# EAGLE schematic DCDC_combined (EAGLE 9.5.1)
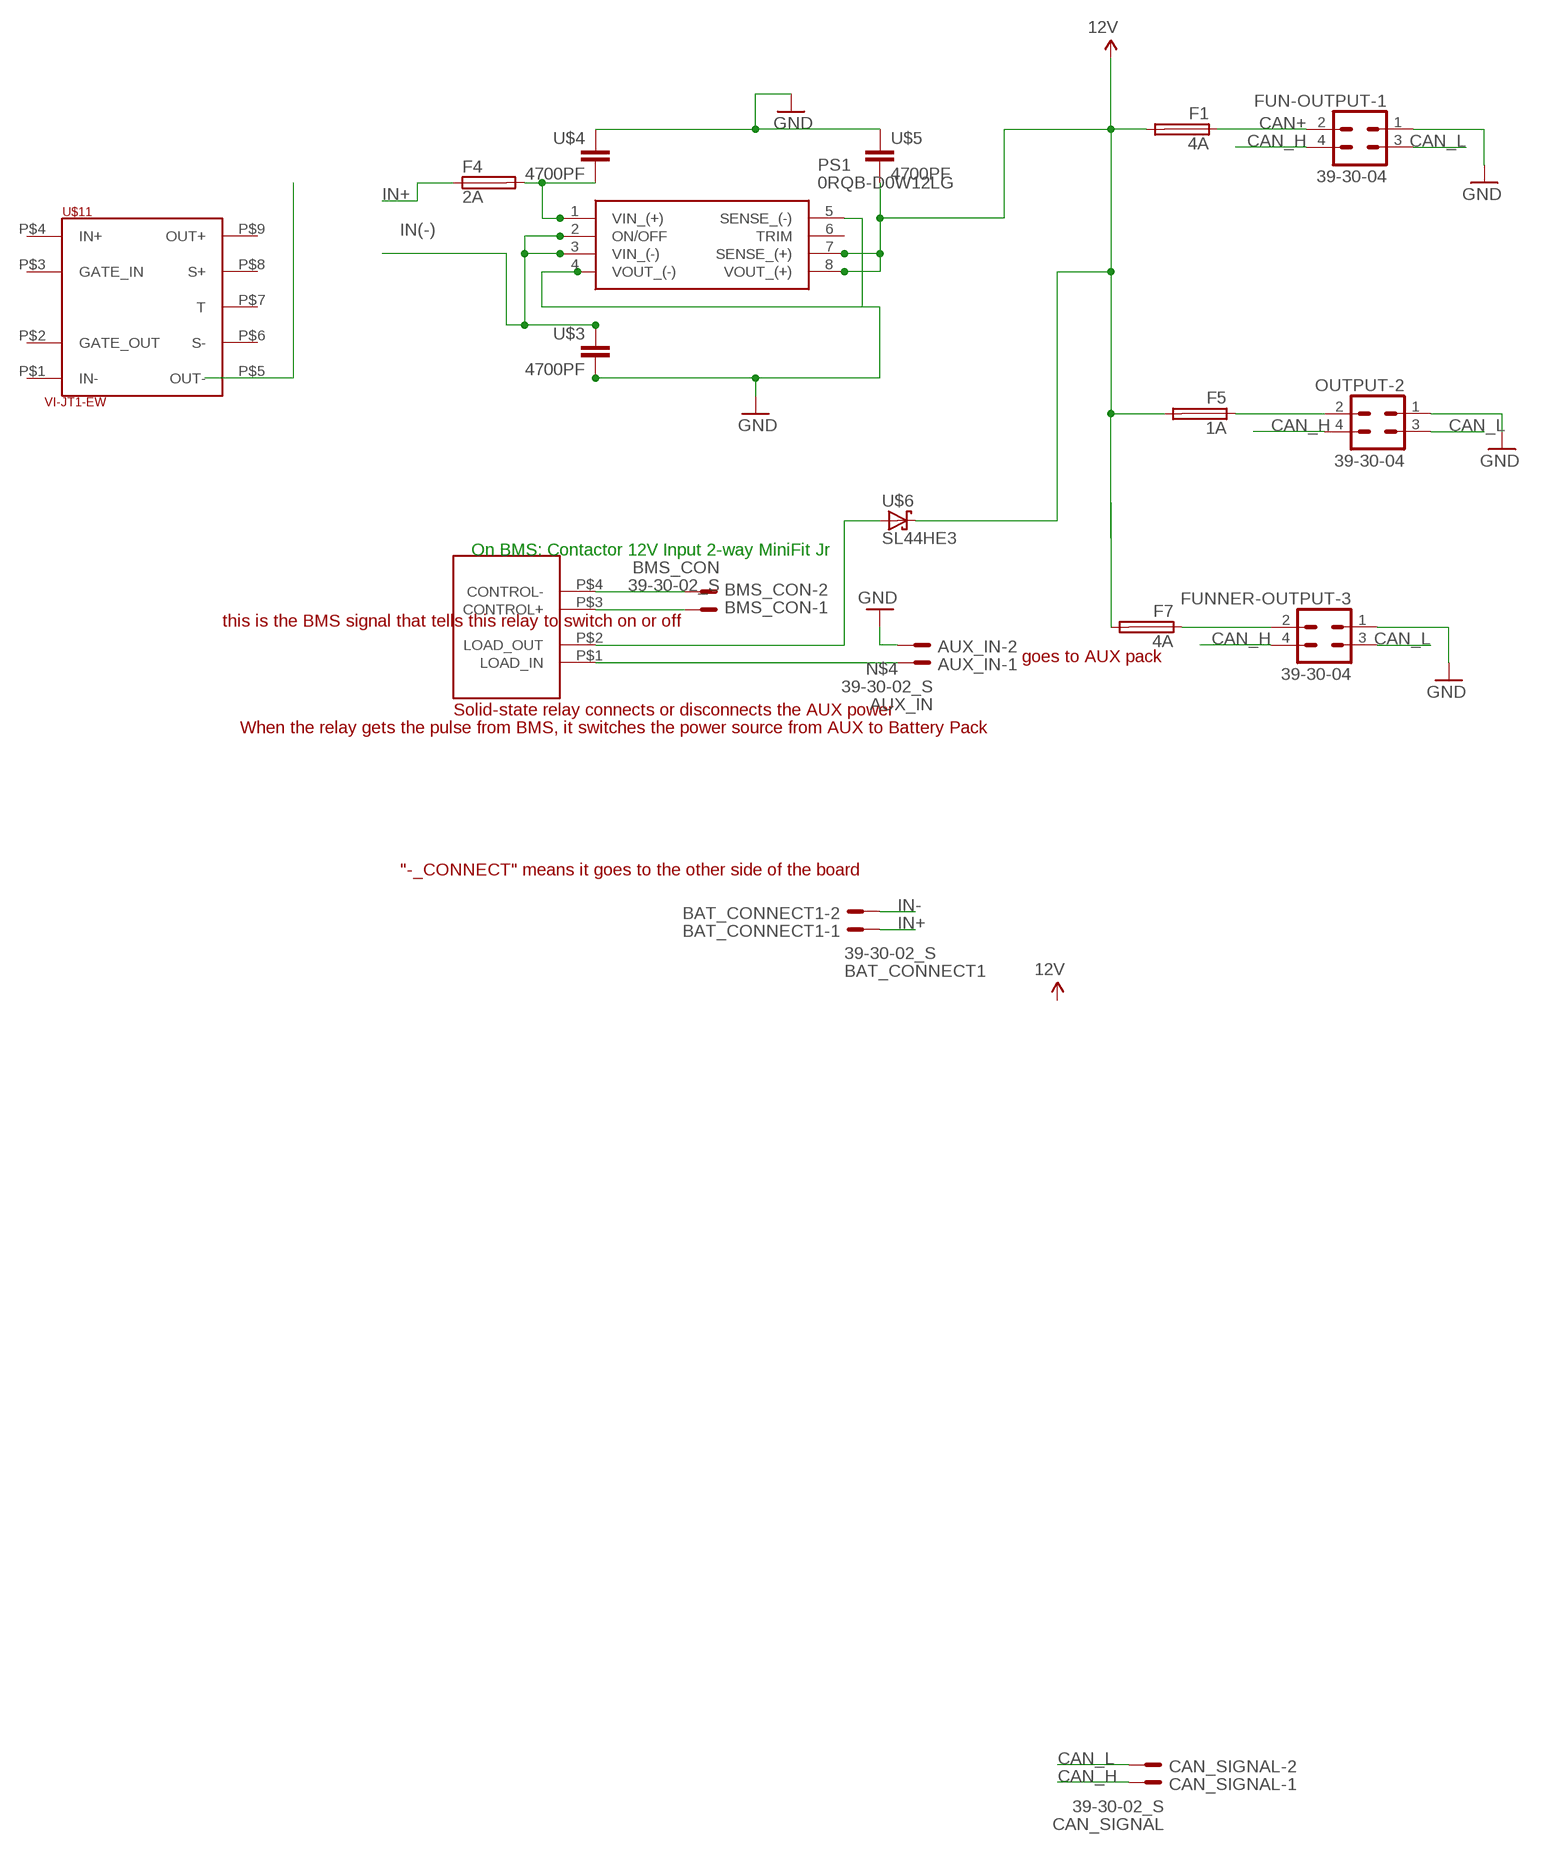
[diagram p0: schematic, sheet 1]

## Parts
AUX_IN  39-30-02_S  [39-30-?02?]
BAT_CONNECT1  39-30-02_S  [39-30-?02?]
BMS_CON  39-30-02_S  [39-30-?02?]
CAN_SIGNAL  39-30-02_S  [39-30-?02?]
F1  4A  SMD-MICRO-FUSE-BLOCK  [OMNIBLOK]
F4  2A  SMD-MICRO-FUSE-BLOCK  [OMNIBLOK]
F5  1A  SMD-MICRO-FUSE-BLOCK  [OMNIBLOK]
F7  4A  SMD-MICRO-FUSE-BLOCK  [OMNIBLOK]
FUN-OUTPUT-1  39-30-04  [39-30-?04?]
FUNNER-OUTPUT-3  39-30-04  [39-30-?04?]
OUTPUT-2  39-30-04  [39-30-?04?]
PS1  0RQB-D0W12LG  [0RQBD0W12LG]
U$2  MPDCD3B  [MPDCD3B]
U$3  4700PF  [Y2_CAP]
U$4  4700PF  [Y2_CAP]
U$5  4700PF  [Y2_CAP]
U$6  SL44HE3  [SMC]
U$11  VI-JT1-EW  [VI-J00]

## Nets
12V: F1.P$2 F5.P$2 PS1.7(SENSE_(+)) PS1.8(VOUT_(+)) U$5.P$2 U$6.C
CAN+: F1.P$1 FUN-OUTPUT-1.2
CAN_H: CAN_SIGNAL.1 FUN-OUTPUT-1.4 FUNNER-OUTPUT-3.4 OUTPUT-2.4
CAN_L: CAN_SIGNAL.2 FUN-OUTPUT-1.3 FUNNER-OUTPUT-3.3 OUTPUT-2.3
GND: AUX_IN.2 FUN-OUTPUT-1.1 FUNNER-OUTPUT-3.1 OUTPUT-2.1 PS1.4(VOUT_(-)) PS1.5(SENSE_(-)) U$3.P$2 U$4.P$1 U$5.P$1
IN(-): PS1.2(ON/OFF) PS1.3(VIN_(-)) U$3.P$1
IN+: BAT_CONNECT1.1 F4.P$1
IN-: BAT_CONNECT1.2
N$2: AUX_IN.1 U$2.P$1(LOAD_IN)
N$3: BMS_CON.1 U$2.P$3(CONTROL+)
N$4: BMS_CON.2 U$2.P$2(LOAD_OUT) U$2.P$4(CONTROL-) U$6.A
N$7: F5.P$1 OUTPUT-2.2
N$9: F4.P$2 PS1.1(VIN_(+)) U$4.P$2
N$10: F7.P$1 FUNNER-OUTPUT-3.2
N$13: F7.P$2
Unconnected: PS1.6(TRIM) U$11.P$1(IN-) U$11.P$2(GATE_OUT) U$11.P$3(GATE_IN) U$11.P$4(IN+) U$11.P$5(OUT-) U$11.P$6(S-) U$11.P$7(T) U$11.P$8(S+) U$11.P$9(OUT+)

## Notes on the sheet
- On BMS: Contactor 12V Input 2-way MiniFit Jr
- this is the BMS signal that tells this relay to switch on or off
- goes to AUX pack
- Solid-state relay connects or disconnects the AUX power
- When the relay gets the pulse from BMS, it switches the power source from AUX to Battery Pack
- "-_CONNECT" means it goes to the other side of the board

## Library data of the parts
AUX_IN BAT_CONNECT1 BMS_CON CAN_SIGNAL = con-molex-mini-fit:39-30-?02?_S: HEADER
F1 F4 F5 F7 = f-lf-omniblok-s:SMD-MICRO-FUSE
FUN-OUTPUT-1 FUNNER-OUTPUT-3 OUTPUT-2 = con-molex-mini-fit:39-30-?04?: HEADER
PS1 = SamacSys_Parts:0RQB-D0W12LG: DC/DC CONVERTER 12V 200W Source: Datasheet <https://belfuse.com/resources/PowerSolutions/0rqb-d0w12l/ds-BPS-0RQB-D0W12L-series.pdf>; DESCRIPTION: DC/DC CONVERTER 12V 200W; HEIGHT: 15mm; MANUFACTURER_NAME: Bel-Stewart; MANUFACTURER_PART_NUMBER: 0RQB-D0W12LG
U$2 = NUSOLAR_Custom:MPDCD3B
U$3-U$5 = NUSOLAR_Custom:4700PF
U$6 = diode:SL44HE3
U$11 = NUSOLAR_Custom:VI-JT1-EW